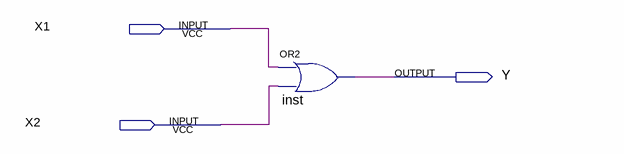
[diagram p0: schematic sheet]
// Quartus schematic CongOR.bdf as structural Verilog: 1 symbols, 3 pins
module CongOR (
  input  X1,
  input  X2,
  output Y
);

  or inst (Y, X1, X2);
endmodule
